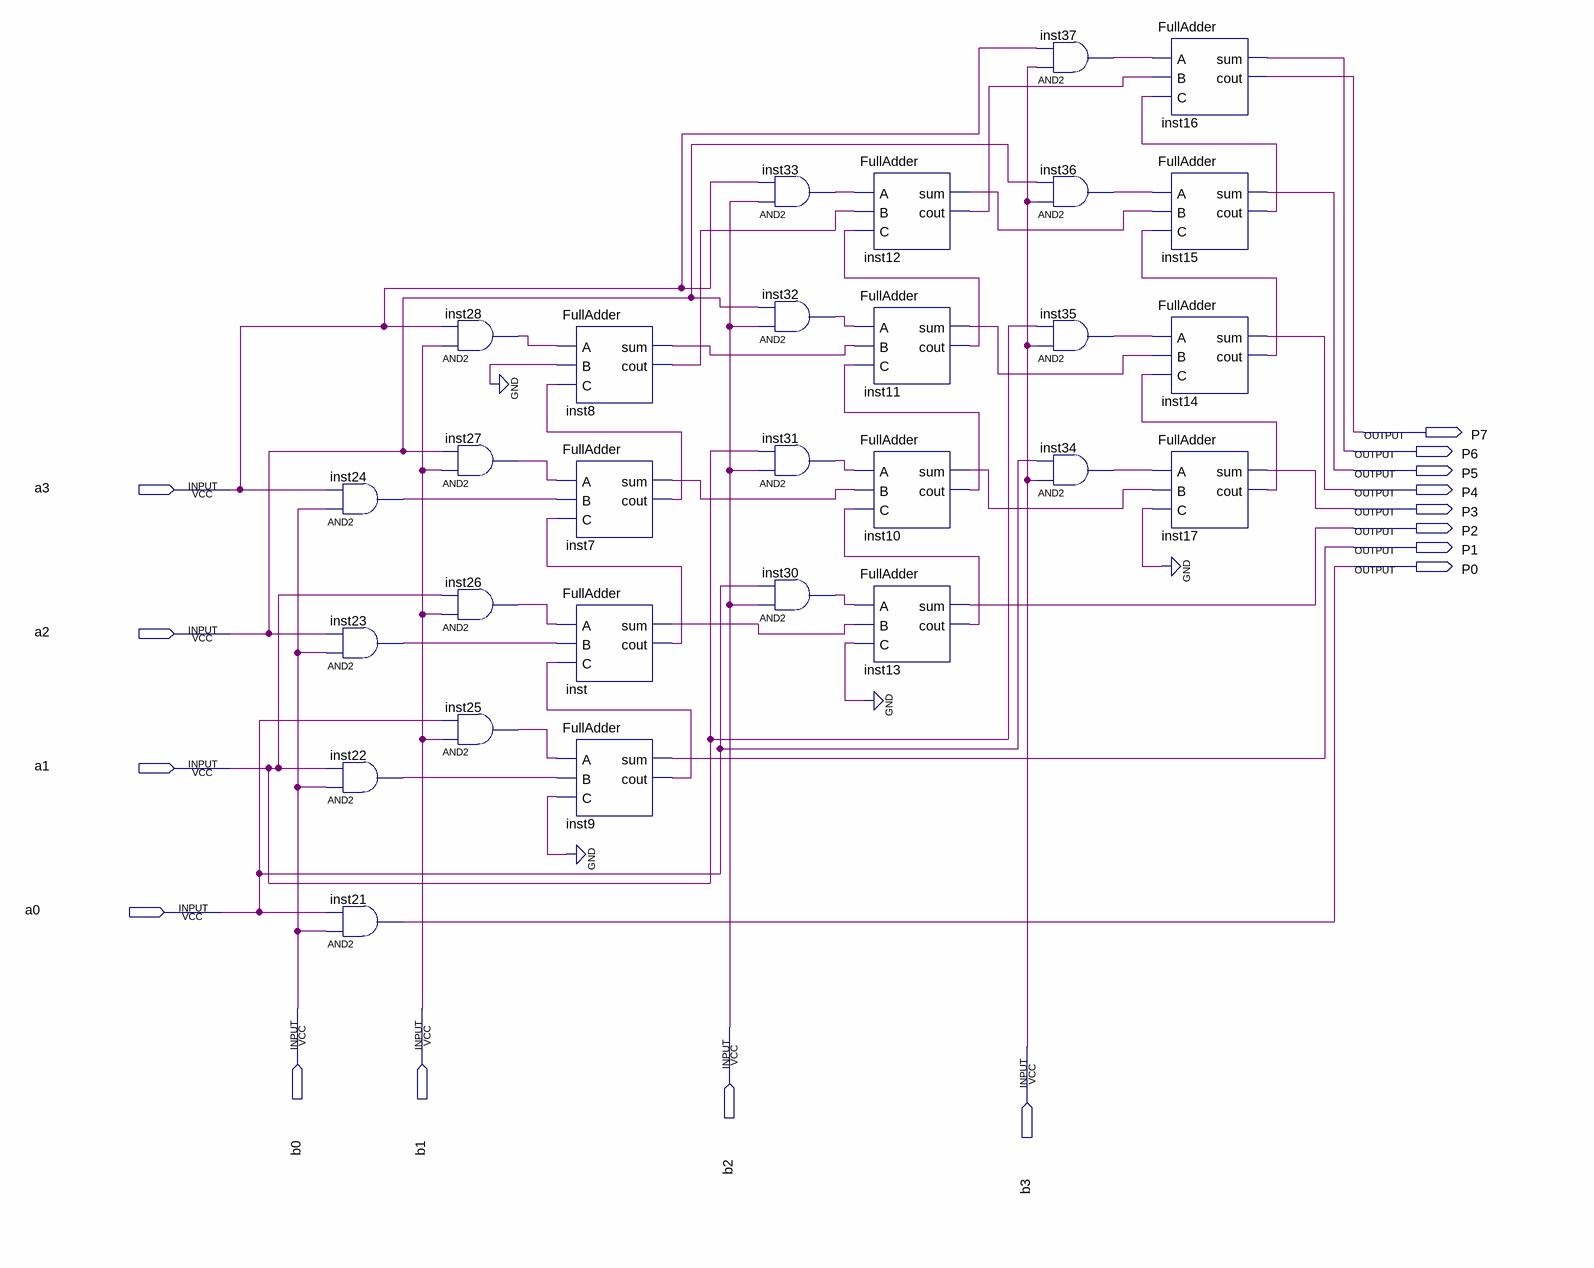
[diagram p0: schematic sheet]
// Quartus schematic Block2.bdf as structural Verilog: 28 symbols, 16 pins
module Block2 (
  input  a3,
  input  a2,
  input  a1,
  input  a0,
  input  b0,
  input  b1,
  input  b2,
  input  b3,
  output P7,
  output P6,
  output P5,
  output P4,
  output P3,
  output P2,
  output P1,
  output P0
);

  wire inst7_cout, inst7_sum, inst8_cout, inst8_sum, inst9_cout, inst10_cout, inst10_sum, inst11_cout,
       inst11_sum, inst12_cout, inst12_sum, inst13_cout, inst14_cout, inst15_cout, inst17_cout, inst22_out,
       inst23_out, inst24_out, inst25_out, inst26_out, inst27_out, inst28_out, inst30_out, inst31_out,
       inst32_out, inst33_out, inst34_out, inst35_out, inst36_out, inst37_out, inst_cout, inst_sum;

  and inst24 (inst24_out, b0, a3);
  and inst23 (inst23_out, b0, a2);
  and inst22 (inst22_out, b0, a1);
  and inst21 (P0, b0, a0);
  and inst28 (inst28_out, b1, a3);
  and inst27 (inst27_out, b1, a2);
  and inst26 (inst26_out, b1, a1);
  and inst25 (inst25_out, b1, a0);
  FullAdder inst8 (.A(inst28_out), .B(1'b0), .C(inst7_cout), .sum(inst8_sum), .cout(inst8_cout));
  FullAdder inst7 (.A(inst27_out), .B(inst24_out), .C(inst_cout), .sum(inst7_sum), .cout(inst7_cout));
  FullAdder inst (.A(inst26_out), .B(inst23_out), .C(inst9_cout), .sum(inst_sum), .cout(inst_cout));
  FullAdder inst9 (.A(inst25_out), .B(inst22_out), .C(1'b0), .sum(P1), .cout(inst9_cout));
  and inst33 (inst33_out, b2, a3);
  and inst32 (inst32_out, b2, a2);
  and inst31 (inst31_out, b2, a1);
  and inst30 (inst30_out, b2, a0);
  FullAdder inst12 (.A(inst33_out), .B(inst8_cout), .C(inst11_cout), .sum(inst12_sum), .cout(inst12_cout));
  FullAdder inst11 (.A(inst32_out), .B(inst8_sum), .C(inst10_cout), .sum(inst11_sum), .cout(inst11_cout));
  FullAdder inst10 (.A(inst31_out), .B(inst7_sum), .C(inst13_cout), .sum(inst10_sum), .cout(inst10_cout));
  FullAdder inst13 (.A(inst30_out), .B(inst_sum), .C(1'b0), .sum(P2), .cout(inst13_cout));
  and inst37 (inst37_out, b3, a3);
  and inst36 (inst36_out, b3, a2);
  and inst35 (inst35_out, b3, a1);
  and inst34 (inst34_out, b3, a0);
  FullAdder inst16 (.A(inst37_out), .B(inst12_cout), .C(inst15_cout), .sum(P6), .cout(P7));
  FullAdder inst15 (.A(inst36_out), .B(inst12_sum), .C(inst14_cout), .sum(P5), .cout(inst15_cout));
  FullAdder inst14 (.A(inst35_out), .B(inst11_sum), .C(inst17_cout), .sum(P4), .cout(inst14_cout));
  FullAdder inst17 (.A(inst34_out), .B(inst10_sum), .C(1'b0), .sum(P3), .cout(inst17_cout));
endmodule
